# EasyEDA Pro project ProPrj_三轮车_2025-08-24.epro, board PCB3
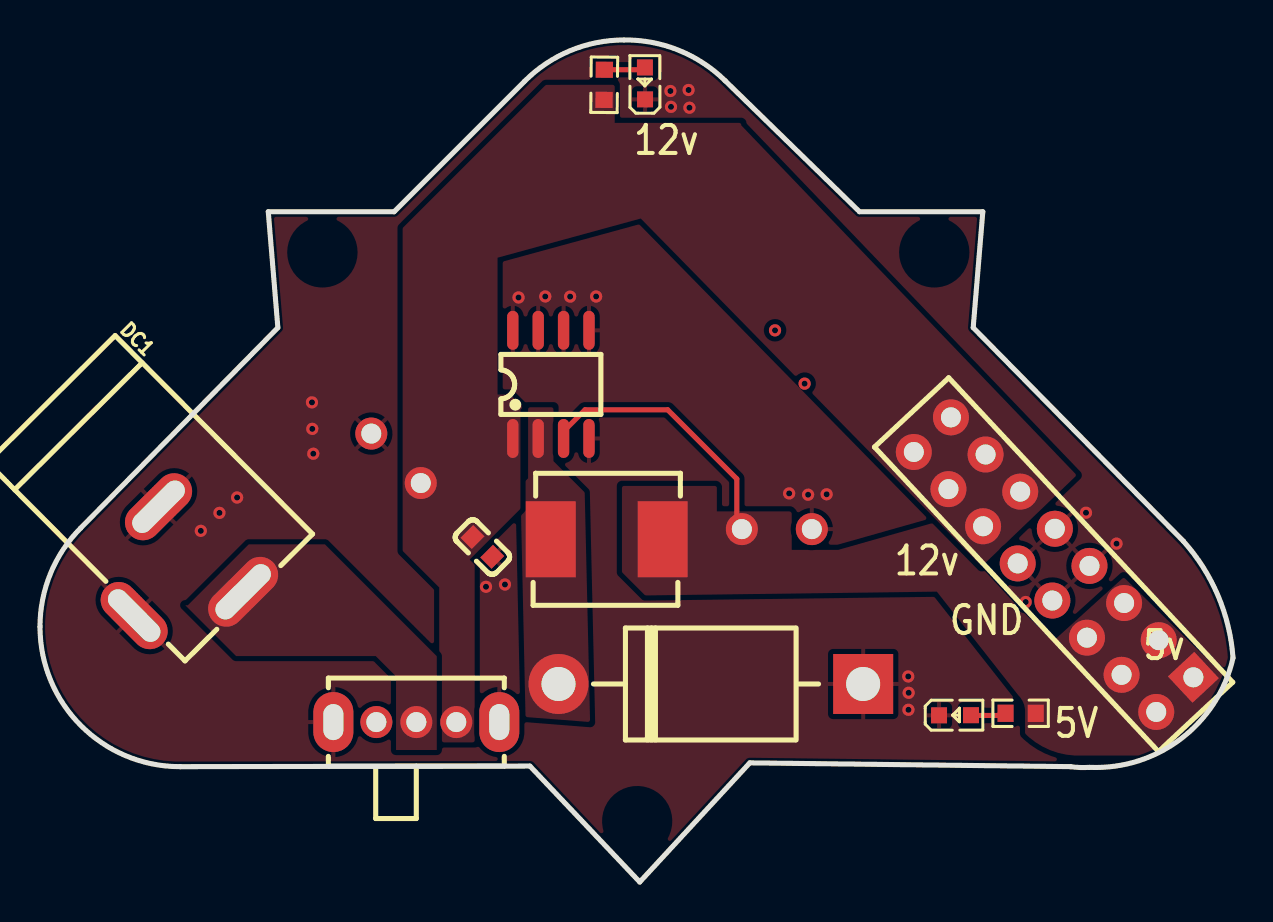
[diagram p10: board, top side]
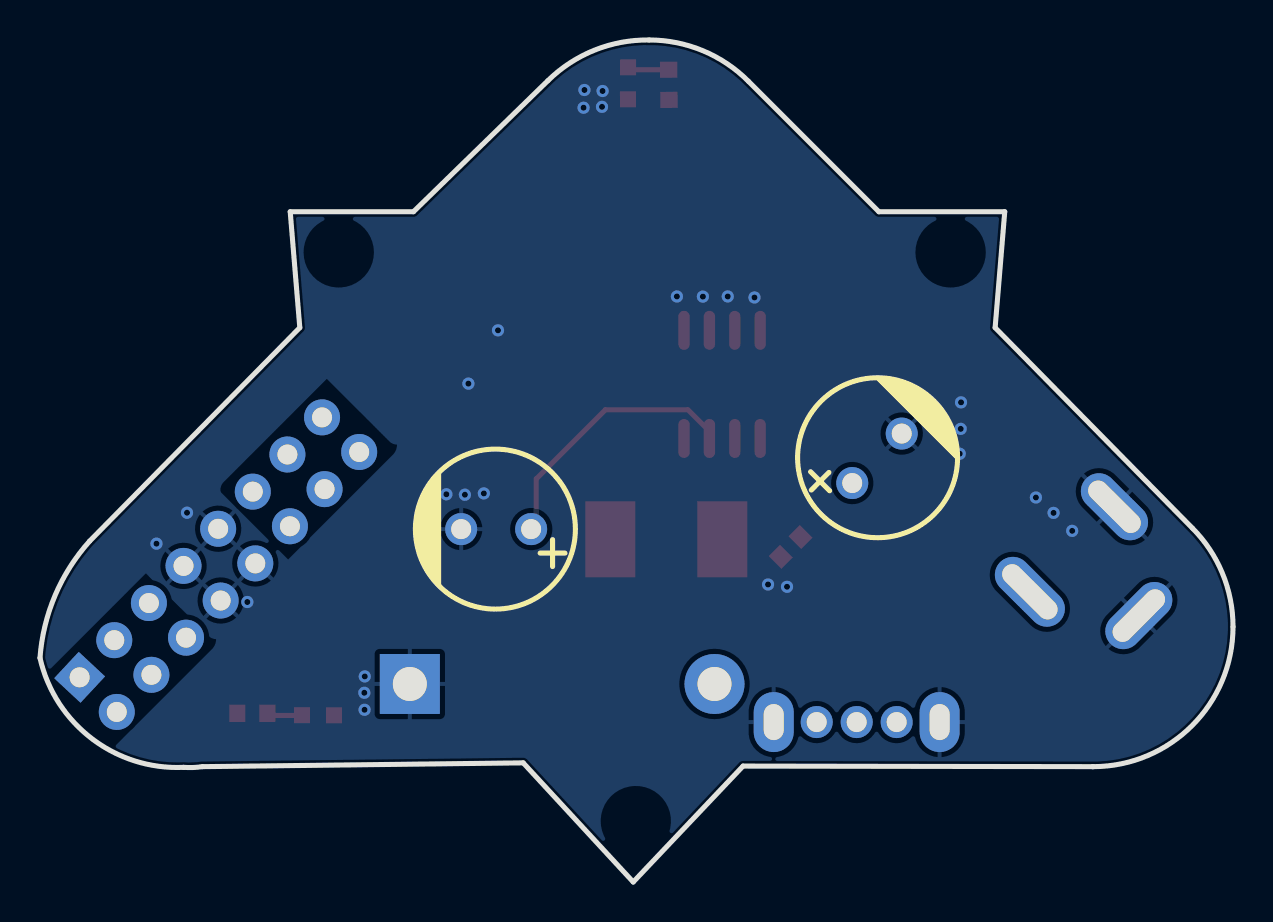
[diagram p11: board, bottom side, seen from below]

Outline 59.68 x 42.12 mm; copper layers: Top Layer, Bottom Layer. Coordinates in mm from the lower left corner of the outline.
Outline path: 0,12.77 arc(0.53,15.44) 2.03,17.7 11.9,27.73 11.42,33.53 17.71,33.53 24.24,40.05 arc(26.52,41.58) 29.21,42.12 arc(31.94,41.61) 34.27,40.09 41,33.53 47.16,33.53 46.68,27.73 57.19,17.05 arc(58.92,14.34) 59.68,11.21 arc(57.08,7.17) 52.49,5.74 arc(52.02,5.73) 51.56,5.77 35.5,5.96 30,0 24.51,5.8 7.02,5.77 arc(7.01,5.77) 7,5.77 arc(2.05,7.82) 0,12.77
Stack: Top Layer 0.035mm / Dielectric1 1.51mm FR4 er 4.5 / Bottom Layer 0.035mm

## Design rules (mm)
template: 自定义配置
spacing copperThickness1oz (default): track to track 0.102, other pairs 0.152 to 0.3
spacing copperThickness2oz: track to track 0.203, other pairs 0.152 to 0.3
track width copperThickness1oz (default): min 0.127, default 0.254, max 2.54
track width copperThickness2oz: min 0.203, default 0.254, max 2.54
differential pair differentialPair (default): width min 0.127, default 0.254, max 2.54; gap min 0.152, default 0.152
via viaSize (default): diameter min 0.5, default 0.61, max 10; hole min 0.3, default 0.305, max 6.3
net 12V uses as
net 5V2A uses as
net $1N992 uses as

## Placement (name value [footprint] x y rotation side)
C7  1uF  [C0603]  22.13 16.76 135 top
C8  180uF  [CAP-TH_BD8.0-P3.50-D0.6-FD]  36.86 17.65 0 bottom
C9  470uF  [CAP-TH_BD8.0-P3.50-D0.6-FD_1]  17.81 21.19 135 bottom
DC1  DC-005-5A-2.0  [DC-IN-TH_DC-005-5A-2.0]  6.38 14.99 314.9 top
J1  2.54-2*8P母  [HDR-TH_16P-P2.54-V-F-R2-C8-S2.54]  50.7 15.87 133 top
L2  68uH  [IND-SMD_L7.1-W6.6-1]  28.35 17.14 180 top
LED1  XL-1608SURC-06  [LED0603-RD_RED]  30.26 39.95 90 top
LED3  XL-1608SURC-06  [LED0603-RD_RED]  45.77 8.34 0 top
R5  10kΩ  [R0603]  49.05 8.44 180 top
R49  10kΩ  [R0603]  28.22 39.88 89.4 top
SW1  SK12D07VG5  [SW-TH_SK12D07VG5]  18.82 8 0 top
U3  XL1509-5.0E1  [SOIC-8_L5.0-W4.0-P1.27-LS6.0-BL]  25.56 24.89 0 top
U4  1N5820-E3/54  [DO-201AD_BD5.3-L8.4-P12.50-D1.4-FD]  33.56 9.91 180 top

## Footprints (pads in the part's own frame, mm; a bottom-side part is the same pattern mirrored in y, then rotated)
C0603
  rect 0.8x0.9 smd: 1(-0.7,0) 2(0.7,0)
CAP-TH_BD8.0-P3.50-D0.6-FD
  round 1.6 hole 1: 1(-1.75,0) 2(1.75,0)
CAP-TH_BD8.0-P3.50-D0.6-FD_1
  round 1.6 hole 1: 1(-1.75,0) 2(1.75,0)
DC-IN-TH_DC-005-5A-2.0
  oval 1.8x4.2 hole 1x3.5: 1(3,2.351)
  oval 1.8x4 hole 1x3.3: 2(-3,2.352)
  oval 4x1.8 hole 3.3x1: 3(-0.001,-2.352)
DO-201AD_BD5.3-L8.4-P12.50-D1.4-FD
  rect 3x3 hole 1.7: 1(-7.62,0)
  round 3 hole 1.7: 2(7.62,0)
HDR-TH_16P-P2.54-V-F-R2-C8-S2.54
  rect 1.8x1.8 hole 1: 1(-8.89,-1.27)
  round 1.8 hole 1: 2(-8.89,1.27) 3(-6.35,-1.27) 4(-6.35,1.27) 5(-3.81,-1.27) 6(-3.81,1.27) 7(-1.27,-1.27) 8(-1.27,1.27) 9(1.27,-1.27) 10(1.27,1.27) 11(3.81,-1.27) 12(3.81,1.27) 13(6.35,-1.27) 14(6.35,1.27) 15(8.89,-1.27) 16(8.89,1.27)
IND-SMD_L7.1-W6.6-1
  rect 2.5x3.8 smd: 1(-2.8,0) 2(2.8,0)
LED0603-RD_RED
  rect 0.8x0.8 smd: 1(-0.799,-0.004) 2(0.799,0.004)
R0603
  rect 0.806x0.864 smd: 1(-0.753,0) 2(0.753,0)
SOIC-8_L5.0-W4.0-P1.27-LS6.0-BL
  oval 0.569x1.95 smd: 1(-1.905,-2.705) 2(-0.635,-2.705) 3(0.635,-2.705) 4(1.905,-2.705) 5(1.905,2.705) 6(0.635,2.705) 7(-0.635,2.705) 8(-1.905,2.705)
SW-TH_SK12D07VG5
  oval 1.6x1.6 hole 1: 1(-2,0) 2(0,0) 3(2,0)
  oval 2x3 hole 1x1.8: 4(4.15,0) 5(-4.15,0)

## Nets
As in the schematic.

Pads without a net: SW1 1

## Via types
v1: diameter 0.61, hole 0.305, Top Layer to Bottom Layer, 27 vias

## Routing (per net, layer and track width the routed paths; a pad name or vN(x,y) marks a point on that pad's centre or on a via; arc(x,y) is an arc through that point)
5V2A: length 13.5
  Top Layer w0.254: U3.3 26.19,22.55 27.27,23.62 31.4,23.62 34.85,20.16 34.85,17.91 C8.1
GND:
  vias: v1(8.04,17.57) v1(8.98,18.46) v1(9.86,19.23) v1(13.6,23.99) v1(13.62,22.67) v1(13.67,21.42) v1(22.31,14.77) v1(23.26,14.88) v1(23.94,29.24) v1(25.27,29.29) v1(26.52,29.28) v1(27.82,29.29) v1(31.53,39.57) v1(31.56,38.78) v1(32.44,39.62) v1(32.49,38.73) v1(36.77,27.6) v1(37.47,19.44) v1(38.25,24.93) v1(38.42,19.37) v1(39.35,19.39) v1(43.43,10.28) v1(43.45,9.47) v1(43.44,8.61) v1(49.31,14.01) v1(52.32,18.47) v1(53.85,16.92)
$1N977: length 2.1
  Top Layer w0.254: R49.2 30.15,40.63 LED1.2
$1N980: length 1.5
  Top Layer w0.254: 48.14,8.33 46.87,8.33 arc(46.77,8.35) 46.69,8.41

## Copper pours and planes (outline as drawn; the poured copper is in the pictures)
5V2A on Top Layer: 59.8,9.77 54.21,15.25 50.68,12.05 49,13.68 44.96,18.04 39.93,16.61 37.6,16.61 37.6,18.46 37.53,18.54 33.86,18.54 33.86,19.76 33.81,19.81 29.11,19.81 29.11,15.49 30.27,14.33 44.86,14.52 48.94,9.33 49.19,8.97 49.28,8.53 49.28,7.43 50.5,6.61 51.94,6.33 55.67,6.33 55.83,6.36 55.96,6.44 56.43,6.54 56.83,6.8
12V on Top Layer: 18.14,32.71 18.14,16.56 19.97,14.73 19.97,6.98 21.75,6.98 21.75,15.87 21.49,16.13 24.03,18.67 24.03,23.62 24.16,23.75 23.52,24.38 22.89,24.38 22.89,31.23 30.05,33.19 47.11,15.79 51.86,20.35 35.08,37.85 35.08,37.97 28.81,37.97 28.75,37.97 28.75,39.88 26.02,39.88 26.01,39.88 25.3,39.88
$1N970 on Top Layer: 7.27,16.89 19.85,16.89 19.85,6.6 7.27,6.6
$1N992 on Top Layer: 24.41,23.75 24.41,20.19 24.03,19.81 24.29,8.25 27.51,8 27.25,19.49 25.68,21.05 25.68,23.75 24.41,23.75
GND on Top Layer: -15.55,50.26 75.57,50.26 84.45,48.49 91.98,43.46 91.98,13.88 90.27,5.28 85.4,-2.02 6.02,-2.02 4.35,-2.35 2.94,-3.3 2.83,-3.18 -3.17,0.82 -10.23,2.23 -14.17,8.11 -15.55,15.06
GND on Bottom Layer: -20.68,52.11 60.5,52.11 76.27,48.97 89.64,40.04 89.64,-4.97 88.97,-8.3 87.09,-11.12 4.3,-11.12 1.64,-10.59 -0.62,-9.08 -7.29,-9.08 -10.4,-8.47 -13.03,-6.7 -18.69,1.77 -20.68,11.76

## Text on the board
Top Silkscreen Layer: 12v | GND | 5V | 5v
